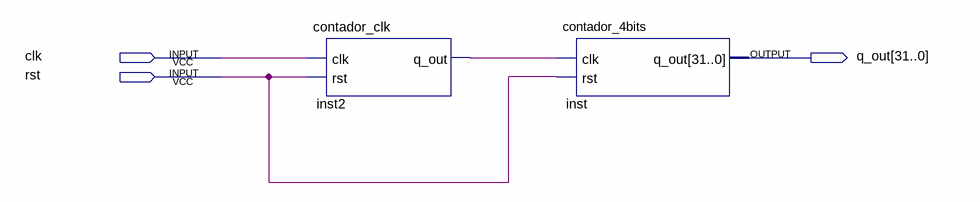
[diagram p0: schematic sheet]
// Quartus schematic main.bdf as structural Verilog: 2 symbols, 3 pins
module main (
  input  clk,
  input  rst,
  output [31:0] q_out
);

  wire inst2_q_out;

  contador_clk inst2 (.clk(clk), .rst(rst), .q_out(inst2_q_out));
  contador_4bits inst (.clk(inst2_q_out), .rst(rst), .q_out(q_out));
endmodule
